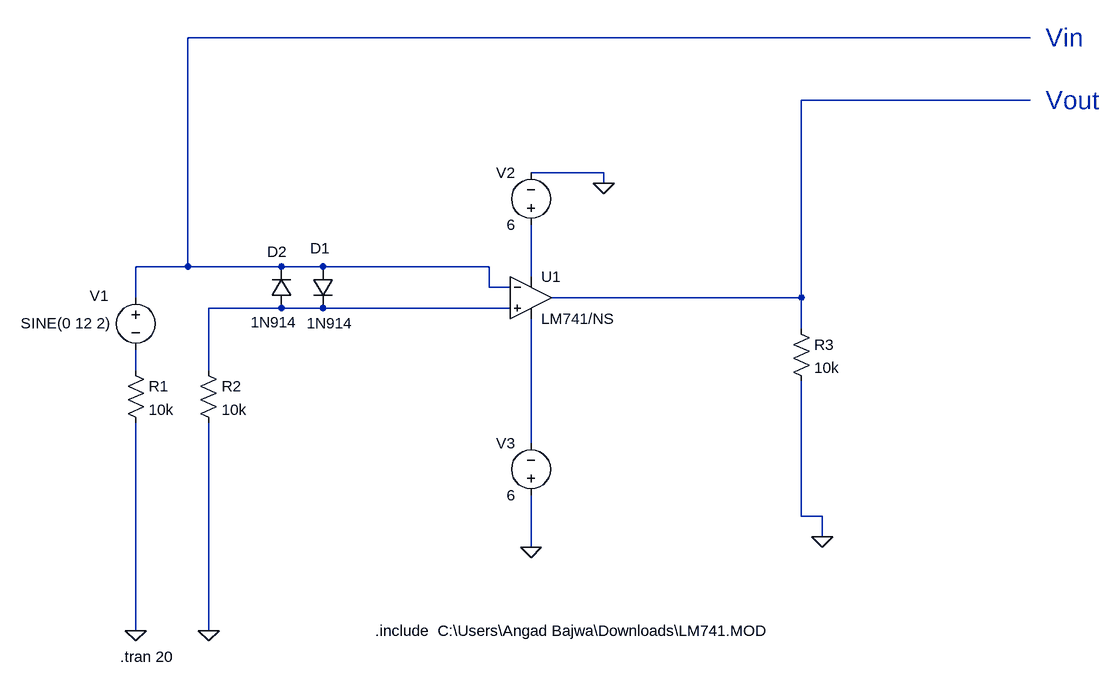
[diagram p0: schematic inverting_zcd.asc]
inverting_zcd.asc, the LTspice schematic file:
Version 4
SHEET 1 880 680
WIRE 464 -368 -832 -368
WIRE 464 -272 112 -272
WIRE -192 -160 -304 -160
WIRE -192 -144 -192 -160
WIRE -832 -16 -832 -368
WIRE -832 -16 -912 -16
WIRE -688 -16 -832 -16
WIRE -624 -16 -688 -16
WIRE -368 -16 -624 -16
WIRE -304 0 -304 -80
WIRE -368 16 -368 -16
WIRE -336 16 -368 16
WIRE -912 32 -912 -16
WIRE 112 32 112 -272
WIRE 112 32 -272 32
WIRE -688 48 -800 48
WIRE -624 48 -688 48
WIRE -336 48 -624 48
WIRE 112 80 112 32
WIRE -912 144 -912 112
WIRE -800 144 -800 48
WIRE -304 256 -304 64
WIRE 112 368 112 160
WIRE 144 368 112 368
WIRE 144 400 144 368
WIRE -304 416 -304 336
WIRE -912 544 -912 224
WIRE -800 544 -800 224
FLAG -912 544 0
FLAG -800 544 0
FLAG -304 416 0
FLAG -192 -144 0
FLAG 144 400 0
SYMBOL res -928 128 R0
SYMATTR InstName R1
SYMATTR Value 10k
SYMBOL res -816 128 R0
SYMATTR InstName R2
SYMATTR Value 10k
SYMBOL res 96 64 R0
SYMATTR InstName R3
SYMATTR Value 10k
SYMBOL voltage -912 16 R0
WINDOW 123 -151 47 Left 2
WINDOW 39 0 0 Left 0
WINDOW 0 -71 13 Left 2
WINDOW 3 -177 55 Left 2
SYMATTR InstName V1
SYMATTR Value SINE(0 12 2)
SYMBOL voltage -304 -64 R180
WINDOW 0 24 96 Left 2
WINDOW 3 24 16 Left 2
WINDOW 123 0 0 Left 0
WINDOW 39 0 0 Left 0
SYMATTR InstName V2
SYMATTR Value 6
SYMBOL diode -640 -16 R0
WINDOW 0 -4 -28 Left 2
WINDOW 3 -9 87 Left 2
SYMATTR InstName D1
SYMATTR Value 1N914
SYMBOL diode -672 48 R180
WINDOW 0 7 87 Left 2
WINDOW 3 -8 -22 Left 2
SYMATTR InstName D2
SYMATTR Value 1N914
SYMBOL voltage -304 352 R180
WINDOW 0 24 96 Left 2
WINDOW 3 24 16 Left 2
WINDOW 123 0 0 Left 0
WINDOW 39 0 0 Left 0
SYMATTR InstName V3
SYMATTR Value 6
SYMBOL OpAmps\\opamp2 -304 -32 R0
SYMATTR InstName U1
SYMATTR Value LM741/NS
TEXT -936 584 Left 2 !.tran 20
TEXT -544 544 Left 2 !.include  C:\\Users\\Angad Bajwa\\Downloads\\LM741.MOD
TEXT 488 -368 Left 4 ;Vin
TEXT 488 -272 Left 4 ;Vout

The netlist it stands for:
* inverting_zcd.asc
R1 N005 0 10k
R2 N004 0 10k
R3 N002 0 10k
V1 N001 N005 SINE(0 12 2)
V2 N003 0 6
D1 N001 N004 1N914
D2 N004 N001 1N914
V3 0 N006 6
XU1 N004 N001 N003 N006 N002 LM741/NS  ; pins In+ In- V+ V- OUT
.model D D
.lib standard.dio
.tran 20
.include  C:\Users\Angad Bajwa\Downloads\LM741.MOD
* Vin
* Vout
.backanno
.end